# Altium schematic sheet main.SchDoc
size A4
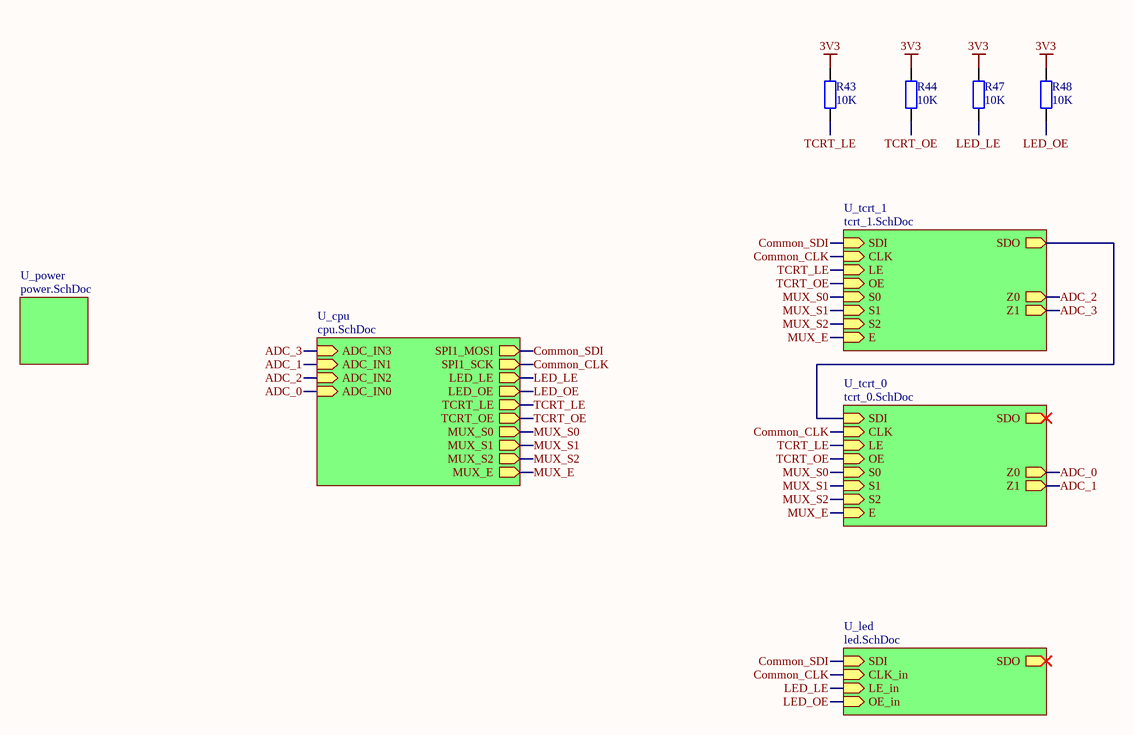
[diagram p0: main.SchDoc]

## Parts
R43  10K  [FP_0805_RES]
R44  10K  [FP_0805_RES]
R47  10K  [FP_0805_RES]
R48  10K  [FP_0805_RES]

## Sub-sheets
U_cpu = cpu.SchDoc: ADC_IN3 (in), ADC_IN1 (in), ADC_IN2 (in), ADC_IN0 (in), SPI1_MOSI (out), SPI1_SCK (out), LED_LE (out), LED_OE (out), TCRT_LE (out), TCRT_OE (out), MUX_S0 (out), MUX_S1 (out), MUX_S2 (out), MUX_E (out)
U_led = led.SchDoc: SDO (out), SDI (in), CLK_in (in), LE_in (in), OE_in (in)
U_power = power.SchDoc: no entries
U_tcrt_0 = tcrt_0.SchDoc: SDO (out), SDI (in), CLK (in), LE (in), OE (in), Z0 (out), Z1 (out), S0 (in), S1 (in), S2 (in), E (in)
U_tcrt_1 = tcrt_1.SchDoc: SDO (out), SDI (in), CLK (in), LE (in), OE (in), Z0 (out), Z1 (out), S0 (in), S1 (in), S2 (in), E (in)

## Nets
3V3: R43.2 R44.2 R47.2 R48.2
ADC_0: sheet U_tcrt_0/Z0, sheet U_cpu/ADC_IN0
ADC_1: sheet U_tcrt_0/Z1, sheet U_cpu/ADC_IN1
ADC_2: sheet U_tcrt_1/Z0, sheet U_cpu/ADC_IN2
ADC_3: sheet U_tcrt_1/Z1, sheet U_cpu/ADC_IN3
Common_CLK: sheet U_tcrt_0/CLK, sheet U_tcrt_1/CLK, sheet U_led/CLK_in, sheet U_cpu/SPI1_SCK
Common_SDI: sheet U_tcrt_1/SDI, sheet U_led/SDI, sheet U_cpu/SPI1_MOSI
LED_LE: R47.1 ; sheet U_led/LE_in, sheet U_cpu/LED_LE
LED_OE: R48.1 ; sheet U_led/OE_in, sheet U_cpu/LED_OE
MUX_E: sheet U_tcrt_0/E, sheet U_tcrt_1/E, sheet U_cpu/MUX_E
MUX_S0: sheet U_tcrt_0/S0, sheet U_tcrt_1/S0, sheet U_cpu/MUX_S0
MUX_S1: sheet U_tcrt_0/S1, sheet U_tcrt_1/S1, sheet U_cpu/MUX_S1
MUX_S2: sheet U_tcrt_0/S2, sheet U_tcrt_1/S2, sheet U_cpu/MUX_S2
TCRT_LE: R43.1 ; sheet U_tcrt_0/LE, sheet U_tcrt_1/LE, sheet U_cpu/TCRT_LE
TCRT_OE: R44.1 ; sheet U_tcrt_0/OE, sheet U_tcrt_1/OE, sheet U_cpu/TCRT_OE
(unnamed): sheet U_tcrt_0/SDI, sheet U_tcrt_1/SDO

## Library data of the parts
R43 R44 R47 R48 = RES: Resistor; Name: 10K0 0805 5% RC0805JR-1010KL 0.125W (YAG); Supplier: Lomex; Reference: 81-34-76; Value: 10K